# Altium schematic sheet microUSB.schdoc
size 76 x 45 mm
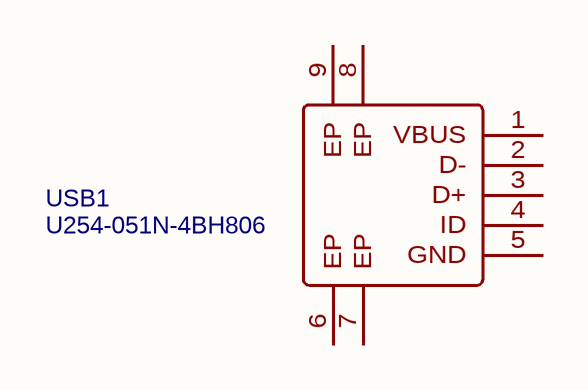
[diagram p0: microUSB.schdoc]

## Parts
USB1  U254-051N-4BH806  [MICRO-USB-SMD_U254-051N-4BH806]

## Nets

Not connected (* = marked no-connect by the designer): USB1 1(VBUS) 2(D-) 3(D+) 4(ID) 5(GND) 6(EP) 7(EP) 8(EP) 9(EP)

## Library data of the parts
USB1 = U254-051N-4BH806: BOM_Manufacturer: XKB Enterprise; Contributor: LCSC; BOM_Supplier: LCSC; BOM_Supplier Part: C319170; BOM_Manufacturer Part: U254-051N-4BH806; spicePre: U; spiceSymbolName: U254-051N-4BH806